# EAGLE design smalltest (EAGLE 9.6.2)
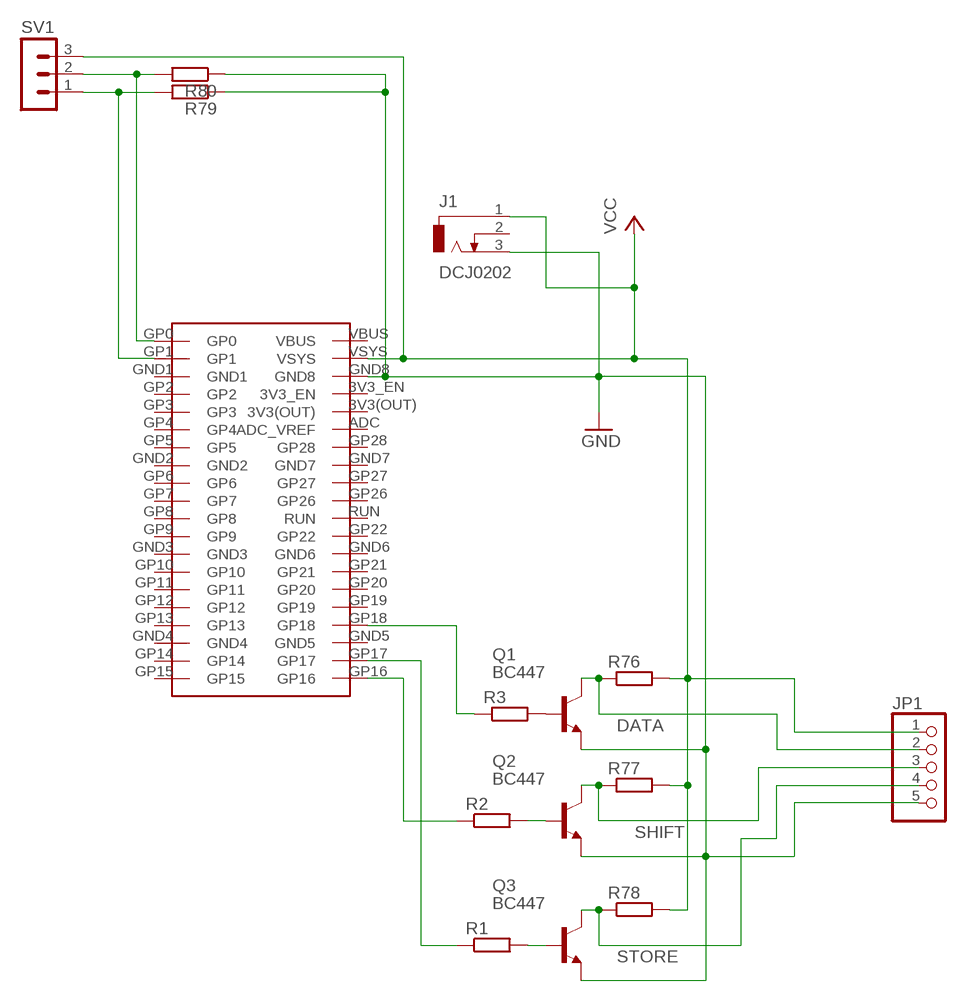
[diagram p0: schematic, sheet 1]

## Parts
J1  DCJ0202  [DCJ0202]
JP1  PINHD-1X5  [1X05]
Q1  BC447  [TO92-EBC]
Q2  BC447  [TO92-EBC]
Q3  BC447  [TO92-EBC]
R1  R-EU_0207/10  [0207/10]
R2  R-EU_0207/10  [0207/10]
R3  R-EU_0207/10  [0207/10]
R76  R-EU_0207/10  [0207/10]
R77  R-EU_0207/10  [0207/10]
R78  R-EU_0207/10  [0207/10]
R79  R-EU_0207/10  [0207/10]
R80  R-EU_0207/10  [0207/10]
SV1  MA03-1  [MA03-1]
U$2  PI_PICO  [PI_PICO]

## Nets
DATA: JP1.2 Q1.C R76.1
GND: J1.3 JP1.5 Q1.E Q2.E Q3.E R79.1 R80.1 U$2.GND8
N$1: R1.1 U$2.GP17
N$2: Q3.B R1.2
N$4: Q2.B R2.2
N$5: Q1.B R3.2
N$6: R3.1 U$2.GP18
N$7: R2.1 U$2.GP16
N$41: R80.2 SV1.2 U$2.GP0
N$43: R79.2 SV1.1 U$2.GP1
SHIFT: JP1.3 Q2.C R77.1
STORE: JP1.4 Q3.C R78.1
VCC: J1.1 JP1.1 R76.2 R77.2 R78.2 SV1.3 U$2.VSYS
Unconnected: J1.2 U$2.3V3(OUT) U$2.3V3_EN U$2.ADC(ADC_VREF) U$2.GND1 U$2.GND2 U$2.GND3 U$2.GND4 U$2.GND5 U$2.GND6 U$2.GND7 U$2.GP2 U$2.GP3 U$2.GP4 U$2.GP5 U$2.GP6 U$2.GP7 U$2.GP8 U$2.GP9 U$2.GP10 U$2.GP11 U$2.GP12 U$2.GP13 U$2.GP14 U$2.GP15 U$2.GP19 U$2.GP20 U$2.GP21 U$2.GP22 U$2.GP26 U$2.GP27 U$2.GP28 U$2.RUN U$2.VBUS

## Library data of the parts
J1 = con-jack:DCJ0202: DC POWER JACK Source: DCJ0202.pdf; OC_FARNELL: unknown; OC_NEWARK: unknown
JP1 = pinhead:PINHD-1X5: PIN HEADER
Q1-Q3 = transistor-npn:BC447*: NPN Transistor
R1-R3 R76-R80 = rcl:R-EU_: RESISTOR, European symbol; SPICEPREFIX: R
SV1 = con-lstb:MA03-1: PIN HEADER; OC_FARNELL: unknown; OC_NEWARK: unknown
U$2 = PI_PICO:PI_PICO

## Board
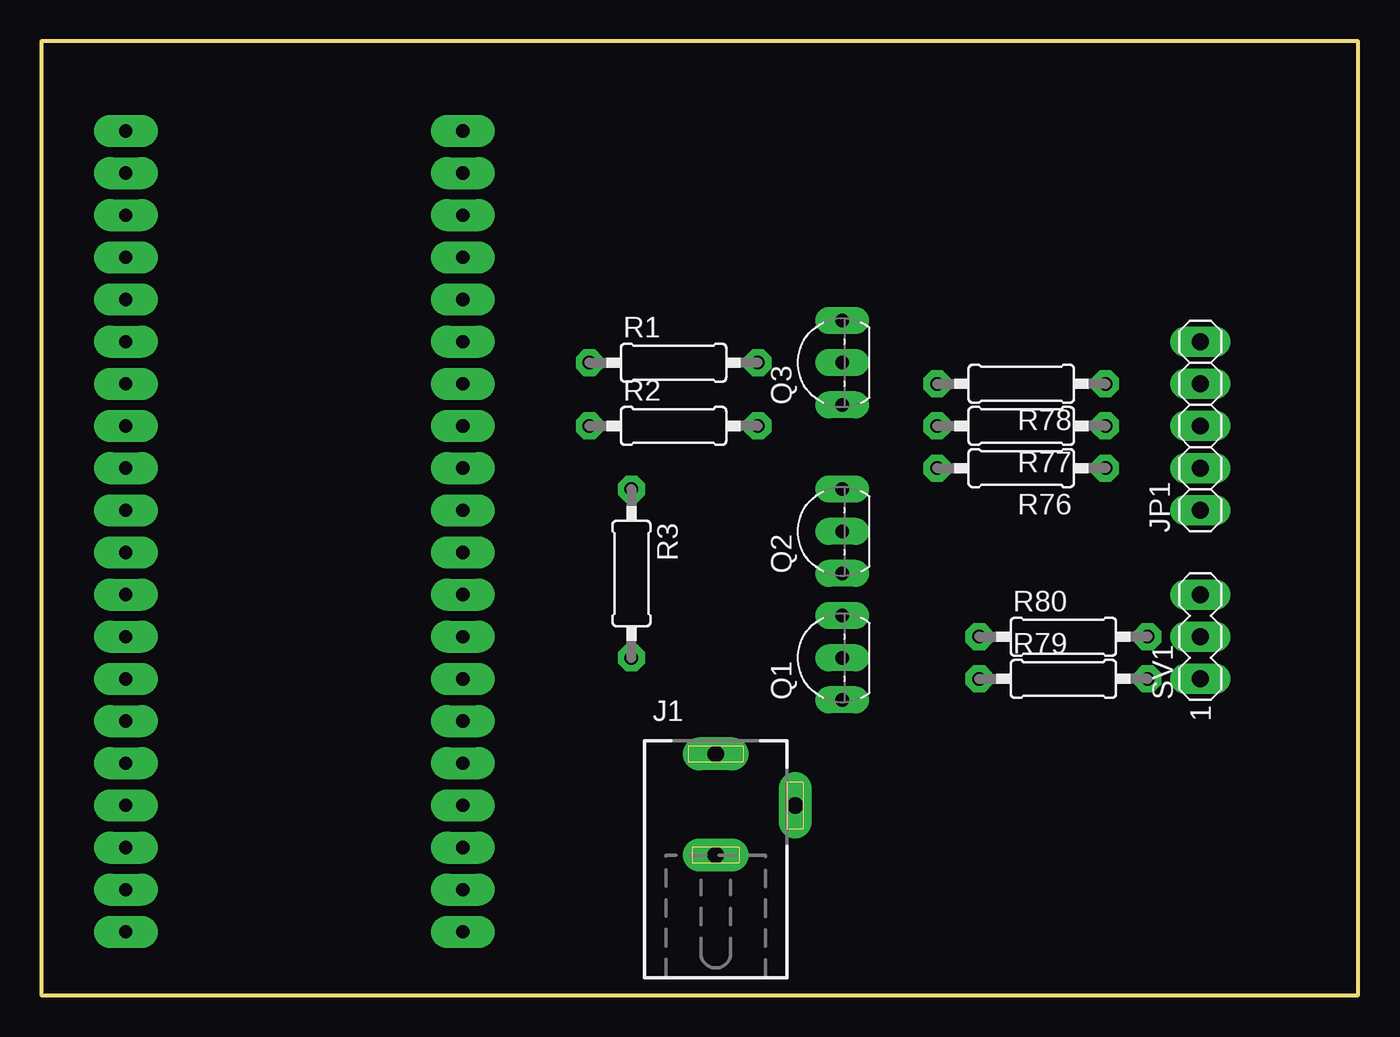
[diagram p1: board, top side]
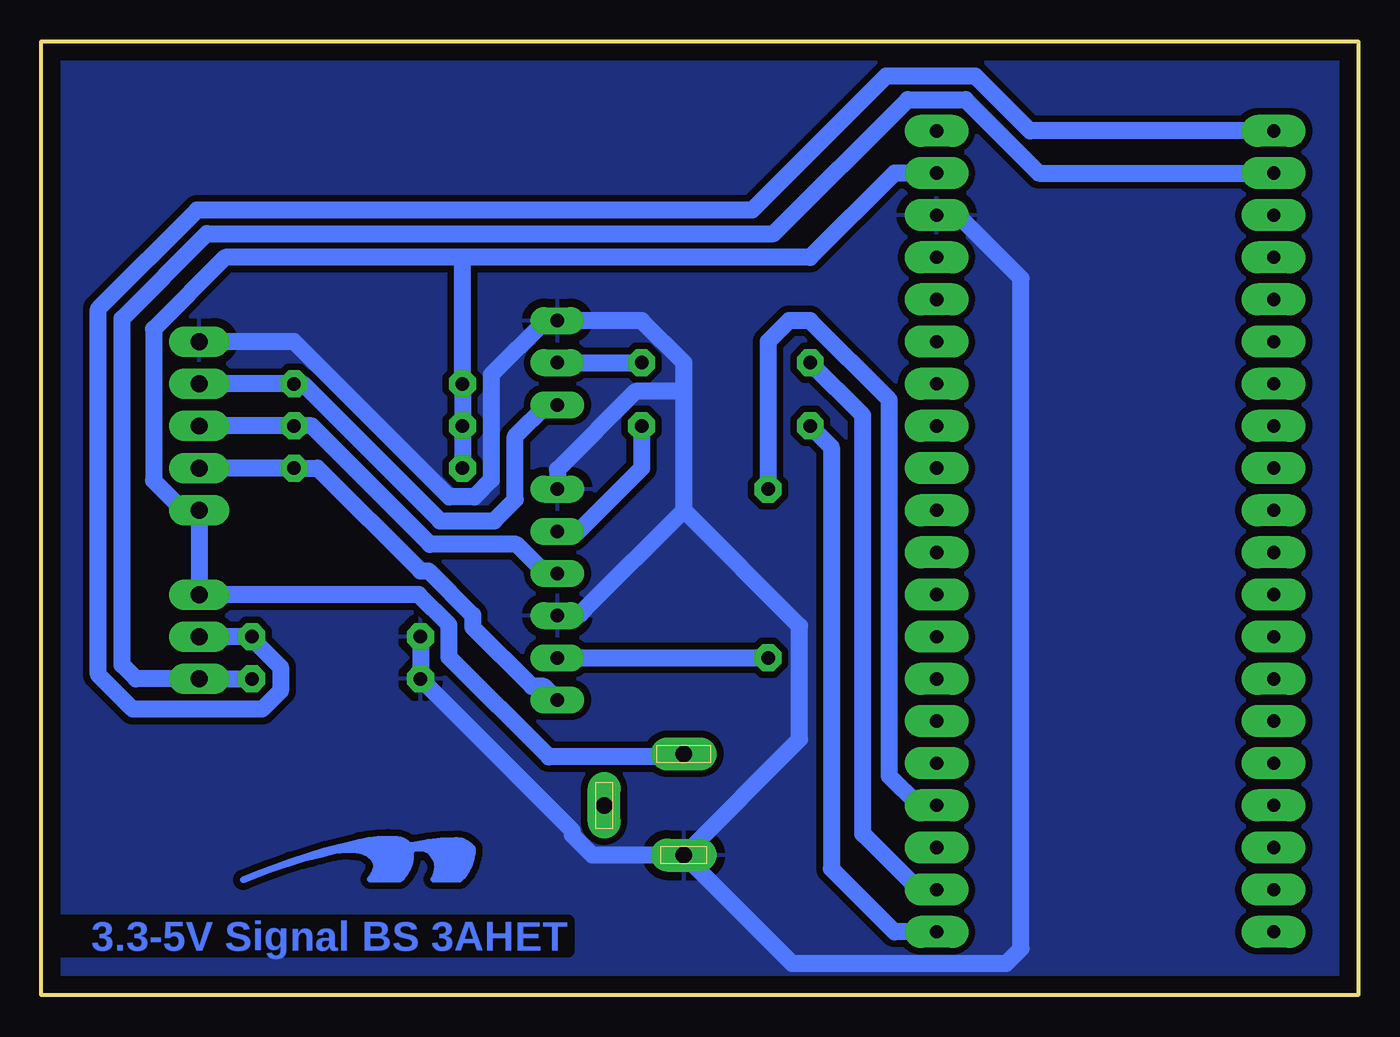
[diagram p2: board, bottom side, seen from below]

Size 79.36 x 57.45 mm. Coordinates in mm from the lower left corner, seen from the top.
Outline: 0,0 79.36,0 79.36,57.45 0,57.45 0,0
Copper layers (1*16): Top 0.035mm / dielectric 1.5mm / Bottom 0.035mm
Design rules "htl": minimum track width 16mil, minimum drill 24mil, track to track 16mil, track to pad 16mil, pad to pad 16mil, via to via 16mil, smd to smd 12mil, copper to edge 40mil, drill to drill 6mil, minimum pad ring 16mil, minimum via ring 16mil, stop-mask expansion 4mil, vias tented up to drill 0mil, thermal gap 20mil

### Footprints (pad centres in the part's own frame; a part is rotated, then mirrored left to right if it is on the bottom)
DCJ0202 = drill 1 pad 2 long: 1 0,3.1; 2 4.8,0; 3 0,-3
1X05 = drill 1.016 long: 1 -5.08,0; 2 -2.54,0; 3 0,0; 4 2.54,0; 5 5.08,0
TO92-EBC = drill 0.813 long: B 0,-1.27; C -2.54,-1.27; E 2.54,-1.27
0207/10 = drill 0.813 octagon: 1 -5.08,0; 2 5.08,0
MA03-1 = drill 1.016 long: 1 -2.54,0; 2 0,0; 3 2.54,0
PI_PICO = drill 0.8 pad 1.93 long: 3V3(OUT) 10.16,15.24; 3V3_EN 10.16,17.78; ADC 10.16,12.7; GND1 -10.16,20.32; GND2 -10.16,7.62; GND3 -10.16,-5.08; GND4 -10.16,-17.78; GND5 10.16,-17.78; GND6 10.16,-5.08; GND7 10.16,7.62; GND8 10.16,20.32; GP0 -10.16,25.4; GP1 -10.16,22.86; GP2 -10.16,17.78; GP3 -10.16,15.24; GP4 -10.16,12.7; GP5 -10.16,10.16; GP6 -10.16,5.08; GP7 -10.16,2.54; GP8 -10.16,0; GP9 -10.16,-2.54; GP10 -10.16,-7.62; GP11 -10.16,-10.16; GP12 -10.16,-12.7; GP13 -10.16,-15.24; GP14 -10.16,-20.32; GP15 -10.16,-22.86; GP16 10.16,-22.86; GP17 10.16,-20.32; GP18 10.16,-15.24; GP19 10.16,-12.7; GP20 10.16,-10.16; GP21 10.16,-7.62; GP22 10.16,-2.54; GP26 10.16,2.54; GP27 10.16,5.08; GP28 10.16,10.16; RUN 10.16,0; VBUS 10.16,25.4; VSYS 10.16,22.86

### Placement (x,y rotation side)
J1  40.64,11.43 0 top
JP1  69.85,34.29 90 top
Q1  46.99,20.32 90 top
Q2  46.99,27.94 90 top
Q3  46.99,38.1 90 top
R1  38.1,38.1 0 top
R2  38.1,34.29 0 top
R3  35.56,25.4 270 top
R76  59.05,31.75 180 top
R77  59.05,34.29 180 top
R78  59.05,36.83 180 top
R79  61.59,19.05 0 top
R80  61.59,21.59 0 top
SV1  69.85,21.59 90 top
U$2  15.24,26.67 0 top
U$3  [LOGOBOT_15]  58.42,6.99 0 top

### Tracks (layer width: path | path; a pad name or v marks a point on that pad's centre or on a via)
DATA
  Bottom 1.016: JP1.2 R76.1 62.71,31.75 56.52,25.55 56.02,25.55 53.37,22.89 53.37,22.17 49.79,18.59 49.07,18.59 Q1.C
GND
  Bottom 1.016: J1.3 34.12,1.91 21.21,1.91 20.32,2.79 20.32,43.18 24.13,46.99 U$2.GND8 | Q1.E 46.99,22.86 46.62,23.23 40.64,29.21 | 40.64,29.21 40.64,36.2 | 40.64,36.2 40.64,38.1 43.18,40.64 Q3.E 48.98,40.64 52.25,37.37 52.25,31.04 53.26,30.02 54.78,30.02 64.13,39.37 JP1.5 | 40.64,36.2 40.82,36.37 43.54,36.37 48.26,31.65 Q2.E | J1.3 33.66,15.41 33.66,22.23 40.64,29.21 | J1.3 46.15,8.43 47.35,9.64 47.35,9.89 R79.1 R80.1
  pour Bottom: 0.64,57.15 78.74,57.15 78.74,0 0.64,0
N$1
  Bottom 1.016: U$2.GP17 25.43,6.38 26.51,6.38 29.84,9.71 29.84,34.92 R1.1
N$2
  Bottom 1.016: Q3.B R1.2
N$4
  Bottom 1.016: R2.2 43.18,31.75 46.99,27.94 Q2.B
N$5
  Bottom 1.016: Q1.B R3.2
N$6
  Bottom 1.016: U$2.GP18 25.43,11.46 26.51,11.46 28.25,13.19 28.25,35.87 33.02,40.64 34.29,40.64 35.56,39.37 R3.1
N$7
  Bottom 1.016: U$2.GP16 27.94,3.81 31.75,7.62 31.75,33.02 R2.1
N$41
  Bottom 1.016: U$2.GP0 19.77,52.07 23.07,55.37 28.45,55.37 36.52,47.3 69.98,47.3 75.92,41.35 75.92,19.3 73.84,17.22 66.06,17.22 64.95,18.34 64.95,19.77 66.67,21.49 R80.2 SV1.2
N$43
  Bottom 1.016: U$2.GP1 19.24,49.53 23.66,53.95 27.14,53.95 35.22,45.87 69.39,45.87 74.5,40.76 74.5,19.89 73.66,19.05 SV1.1 R79.2
SHIFT
  Bottom 1.016: Q2.C 48.98,25.4 50.73,27.15 55.93,27.15 63.07,34.29 R77.1 JP1.3
STORE
  Bottom 1.016: JP1.4 R78.1 63.6,36.83 55.34,28.57 52.07,28.57 50.8,29.84 50.8,33.66 48.9,35.56 Q3.C
VCC
  Bottom 1.016: R76.2 R77.2 R78.2 53.98,44.45 | U$2.VSYS 27.94,49.53 33.02,44.45 53.98,44.45 | J1.1 40.83,14.34 48.77,14.34 54.79,20.36 54.79,22.3 56.61,24.13 SV1.3 JP1.1 70.81,29.21 72.59,30.99 72.59,40.13 68.27,44.45 53.98,44.45

### Text on the board
Bottom: 3.3-5V Signal BS 3AHET